# EAGLE design Breakout_Cable (EAGLE 7.5.0)
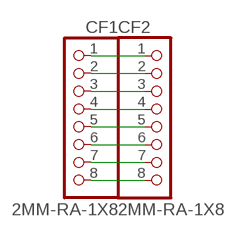
[diagram p0: schematic, sheet 1]

## Parts
CF1  2MM-RA-1X8  [CF-2MM-RA-1X8-PRECIDIP-831]
CF2  2MM-RA-1X8  [CF-2MM-RA-1X8-PRECIDIP-831]

## Nets
N$1: CF1.1 CF2.1
N$2: CF1.2 CF2.2
N$3: CF1.3 CF2.3
N$4: CF1.4 CF2.4
N$5: CF1.5 CF2.5
N$6: CF1.6 CF2.6
N$7: CF1.7 CF2.7
N$8: CF1.8 CF2.8

## Library data of the parts
CF1 CF2 = 2mm-RA-solar-module-debugging:2MM-RA-1X8

## Board
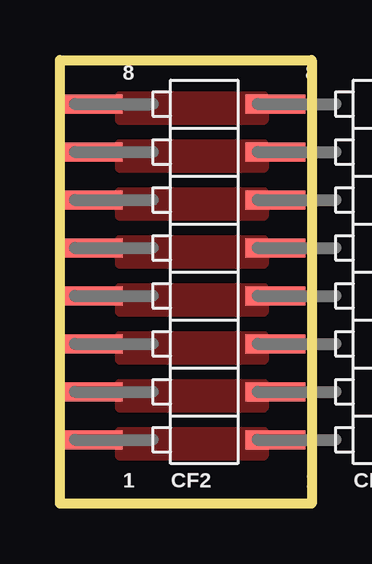
[diagram p1: board, top side]

Size 10.5 x 18.5 mm. Coordinates in mm from the lower left corner, seen from the top.
Outline: 0,18.5 10.5,18.5 10.5,0 0,0 0,18.5
Copper layers (1*16): Top 0.035mm / dielectric 1.5mm / Bottom 0.035mm
Design rules "default": minimum track width 10mil, minimum drill 24mil, track to track 8mil, track to pad 8mil, pad to pad 8mil, via to via 8mil, smd to smd 8mil, copper to edge 40mil, drill to drill 8mil, minimum pad ring 10mil, minimum via ring 8mil, stop-mask expansion 4mil, vias tented up to drill 0mil, thermal gap 10mil

### Footprints (pad centres in the part's own frame; a part is rotated, then mirrored left to right if it is on the bottom)
CF-2MM-RA-1X8-PRECIDIP-831 = smd 2.5 x 0.8: 1 -3.25,-7; 2 -3.25,-5; 3 -3.25,-3; 4 -3.25,-1; 5 -3.25,1; 6 -3.25,3; 7 -3.25,5; 8 -3.25,7

### Placement (x,y rotation side)
CF1  12.24,9.66 0 top
CF2  4.62,9.66 0 top

### Tracks (layer width: path | path; a pad name or v marks a point on that pad's centre or on a via)
N$1
  pour Top (no thermals): 2.5,3 8.5,3 8.5,2 2.5,2
N$2
  pour Top (no thermals): 2.5,5 8.5,5 8.5,4 2.5,4
N$3
  pour Top (no thermals): 2.5,7 8.5,7 8.5,6 2.5,6
N$4
  pour Top (no thermals): 2.5,9 8.5,9 8.5,8 2.5,8
N$5
  pour Top (no thermals): 2.5,11 8.5,11 8.5,10 2.5,10
N$6
  pour Top (no thermals): 2.5,13 8.5,13 8.5,12 2.5,12
N$7
  pour Top (no thermals): 2.5,15 8.5,15 8.5,14 2.5,14
N$8
  pour Top (no thermals): 2.5,17 8.5,17 8.5,16 2.5,16